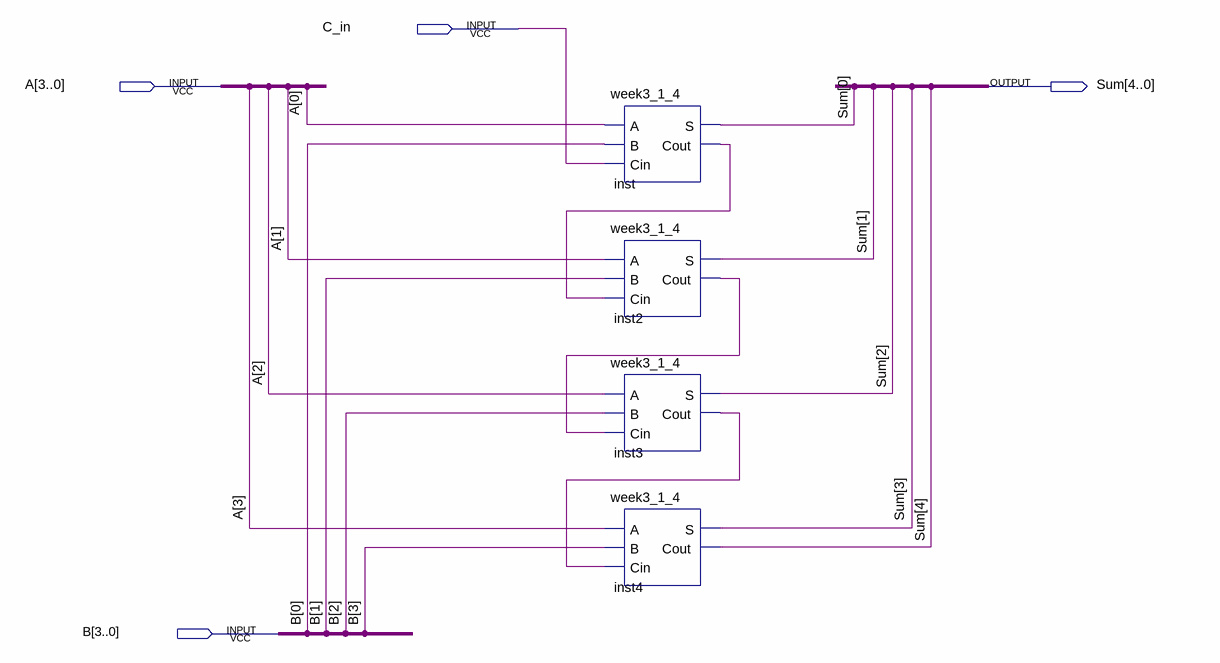
[diagram p0: schematic sheet]
// Quartus schematic four_bit_ripple_carry_adder_v3.bdf as structural Verilog: 4 symbols, 4 pins
module four_bit_ripple_carry_adder_v3 (
  input  C_in,
  input  [3:0] A,
  input  [3:0] B,
  output [4:0] Sum
);

  wire inst2_cout, inst3_cout, inst_cout;

  week3_1_4 inst (.A(A[0]), .B(B[0]), .Cin(C_in), .S(Sum[0]), .Cout(inst_cout));
  week3_1_4 inst2 (.A(A[1]), .B(B[1]), .Cin(inst_cout), .S(Sum[1]), .Cout(inst2_cout));
  week3_1_4 inst3 (.A(A[2]), .B(B[2]), .Cin(inst2_cout), .S(Sum[2]), .Cout(inst3_cout));
  week3_1_4 inst4 (.A(A[3]), .B(B[3]), .Cin(inst3_cout), .S(Sum[3]), .Cout(Sum[4]));
endmodule
